# EAGLE design AST1032 (EAGLE 6.3)
DATABASE: ./../../../../../Components/TinyCircuits_Part_Database.txt
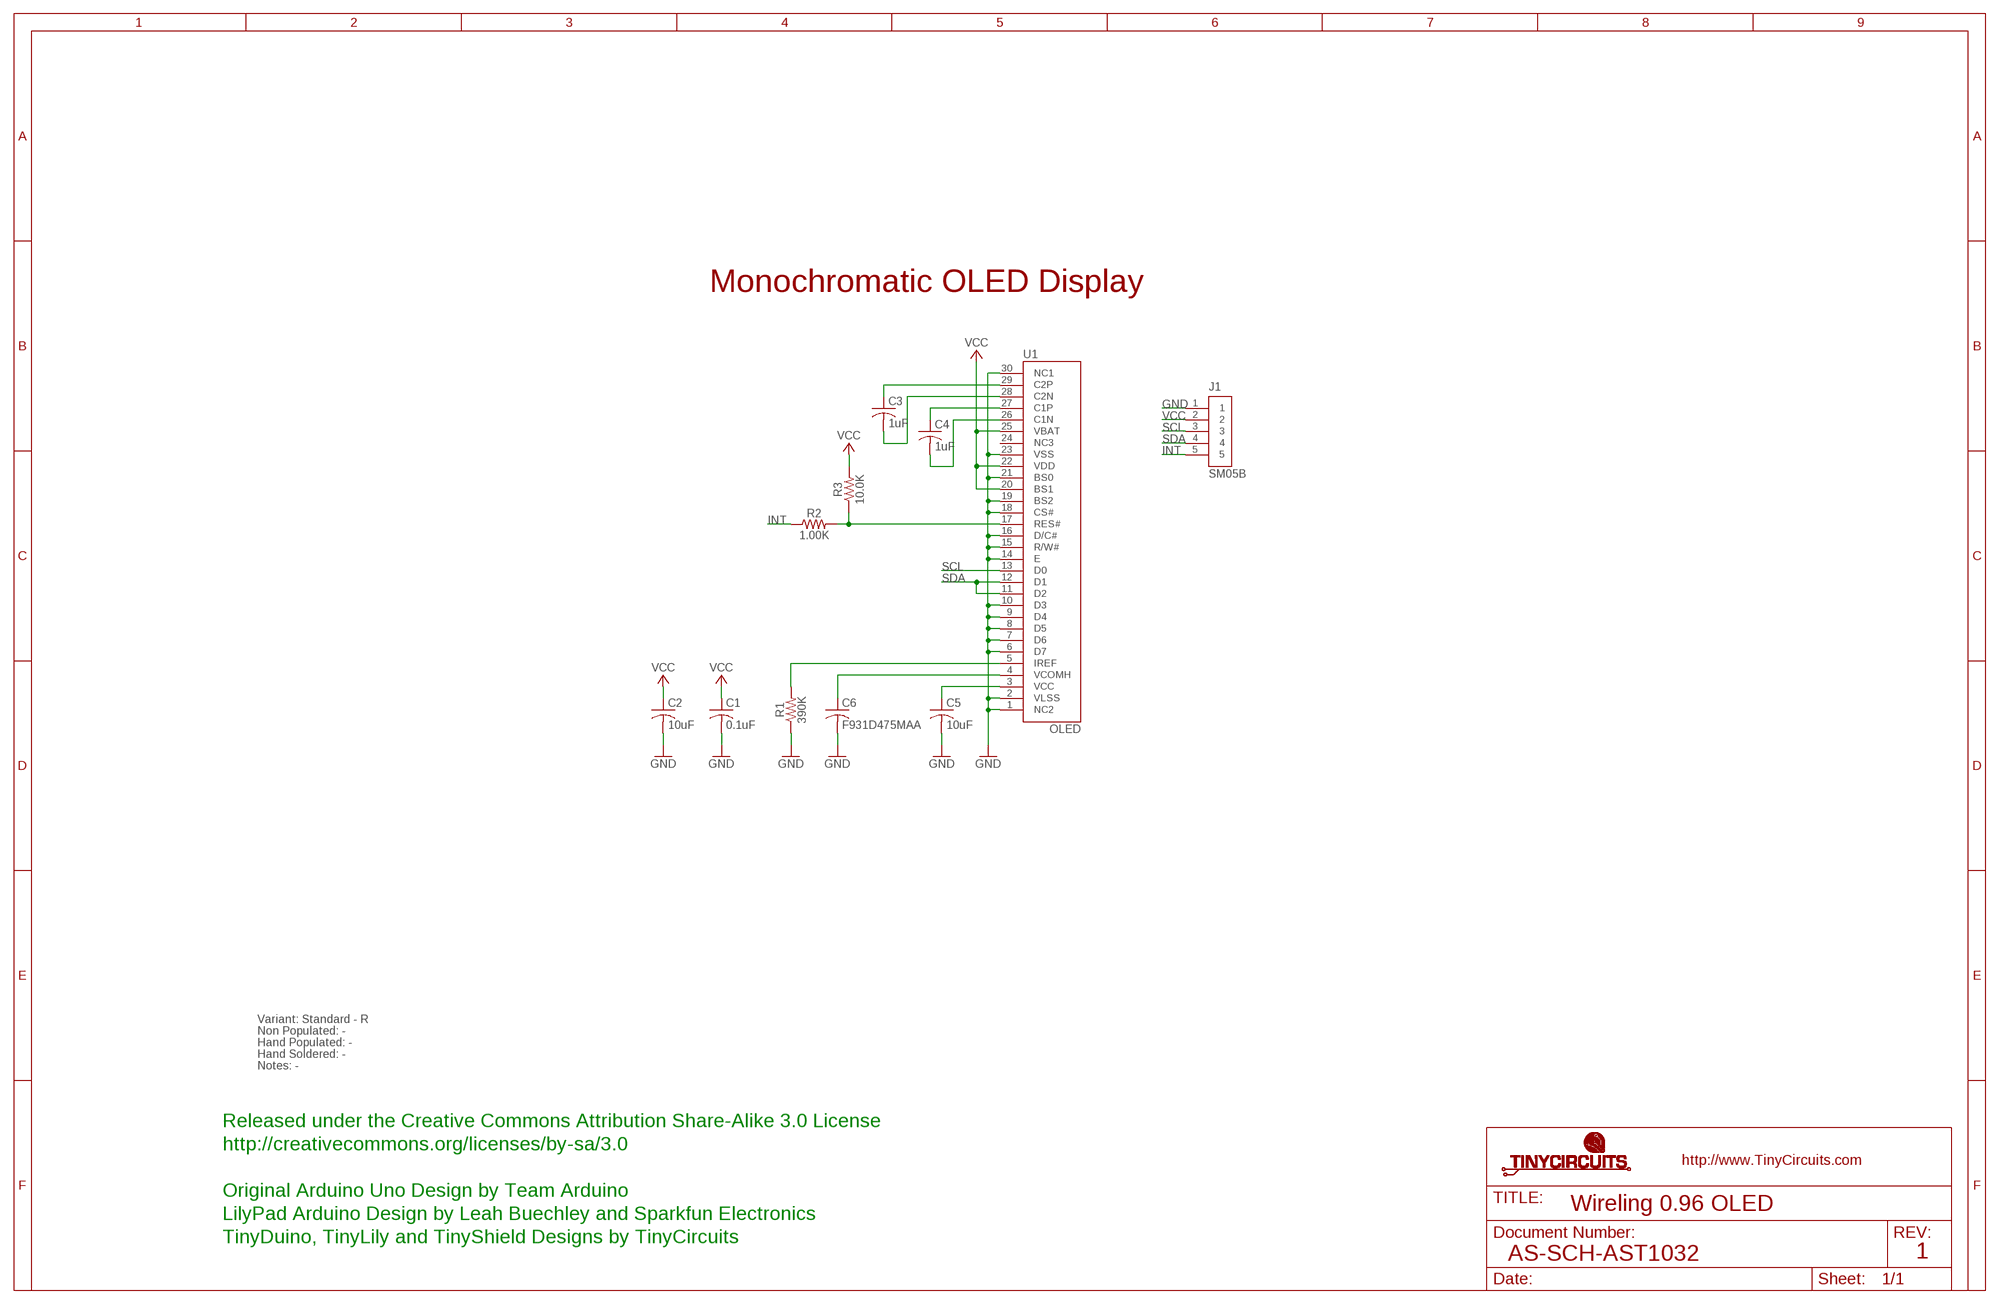
[diagram p0: schematic, sheet 1]

## Parts
C1  0.1uF  AS-ITM-00008  [C0402]
C2  10uF  AS-ITM-00002  [C0603]
C3  1uF  AS-ITM-00347  [C0603]
C4  1uF  AS-ITM-00347  [C0603]
C5  10uF  AS-ITM-00045  [C0805]
C6  F931D475MAA  AS-ITM-00232  [1206_CAP_TANT]
J1  SM05B  AS-ITM-00340  [JST_SH_5X1]
R1  390K  AS-ITM-00346  [0402]
R2  1.00K  AS-ITM-00003  [0402]
R3  10.0K  AS-ITM-00032  [0402]
U1  OLED  AS-ITM-003411  [OLED_WHITE_30P]

## Nets
GND: C1.2 C2.2 C5.2 C6.2 J1.1 R1.1 U1.1(NC2) U1.2(VLSS) U1.6(D7) U1.7(D6) U1.8(D5) U1.9(D4) U1.10(D3) U1.14(E) U1.15(R/W#) U1.16(D/C#) U1.18(CS#) U1.19(BS2) U1.21(BS0) U1.23(VSS) U1.30(NC1)
INT: J1.5 R2.1
N$1: C3.1 U1.29(C2P)
N$2: C3.2 U1.28(C2N)
N$3: C6.1 U1.4(VCOMH)
N$4: C4.1 U1.27(C1P)
N$5: C4.2 U1.26(C1N)
N$7: R1.2 U1.5(IREF)
N$8: C5.1 U1.3(VCC)
N$9: R2.2 R3.1 U1.17(RES#)
SCL: J1.3 U1.13(D0)
SDA: J1.4 U1.11(D2) U1.12(D1)
VCC: C1.1 C2.1 J1.2 R3.2 U1.20(BS1) U1.22(VDD) U1.25(VBAT)
Unconnected: U1.24(NC3)

## Notes on the sheet
- Monochromatic OLED Display
- Variant: Standard - R
- Non Populated: -
- Hand Populated: -
- Hand Soldered: -
- Notes: -
- Released under the Creative Commons Attribution Share-Alike 3.0 License
- http://creativecommons.org/licenses/by-sa/3.0
- Original Arduino Uno Design by Team Arduino
- Wireling 0.96 OLED
- LilyPad Arduino Design by Leah Buechley and Sparkfun Electronics
- TinyDuino, TinyLily and TinyShield Designs by TinyCircuits
- AS-SCH-AST1032 | 1

## Library data of the parts
C1 = tinycircuits:AS-ITM-00008: CAP CER 0.1UF 16V 10% X5R 0402; PARTNO: AS-ITM-00008
C2 = tinycircuits:AS-ITM-00002: CAP CER 10UF 10V 20% X5R 0603; PARTNO: AS-ITM-00002
C3 C4 = tinycircuits:AS-ITM-00347: CAP CER 1UF 16V X7R 0603; PARTNO: AS-ITM-00347
C5 = tinycircuits:AS-ITM-00045: CAP CER 16UF 16V 20% X5R 0805; PARTNO: AS-ITM-00045
C6 = tinycircuits:AS-ITM-00232: CAP TANT 4.7UF 20V 20% 1206; PARTNO: AS-ITM-00232; PNPROTATION: 180
J1 = tinycircuits:AS-ITM-00340: CONN HEADER SH 5POS SIDE 1MM TIN; PARTNO: AS-ITM-00340; PNPROTATION: 180
R1 = tinycircuits:AS-ITM-00346: RES SMD 390K OHM 1% 1/16W 0402; PARTNO: AS-ITM-00346
R2 = tinycircuits:AS-ITM-00003: RES 1.00K OHM 1/16W 1% 0402; PARTNO: AS-ITM-00003
R3 = tinycircuits:AS-ITM-00032: RES 10.0K OHM 1/16W 1% 0402 SMD; PARTNO: AS-ITM-00032
U1 = tinycircuits:AS-ITM-00341: OLED SCREEN WHITE 0.96" 128X64; PARTNO: AS-ITM-00341

## Net classes
2 gnd: width 0.305 mm, drill 0.559 mm, clearance 0.254 mm

## Board
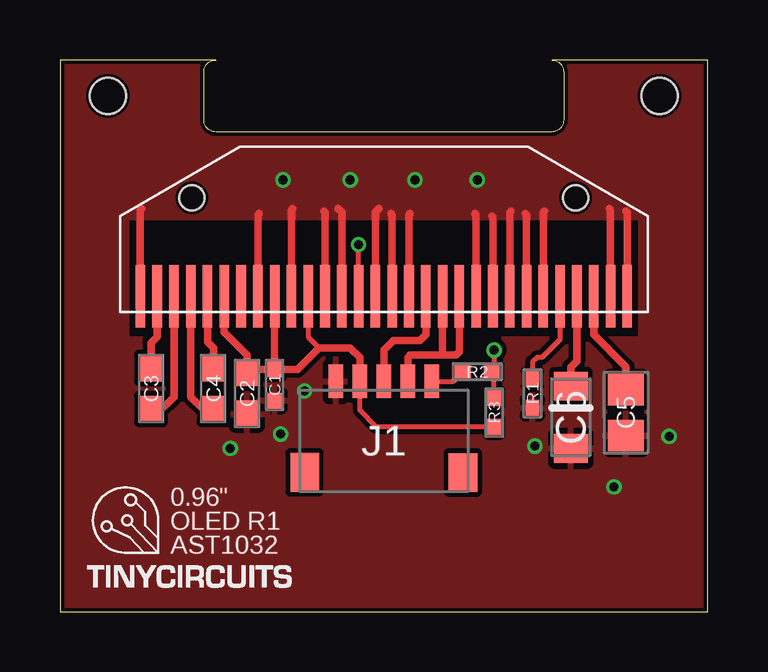
[diagram p1: board, top side]
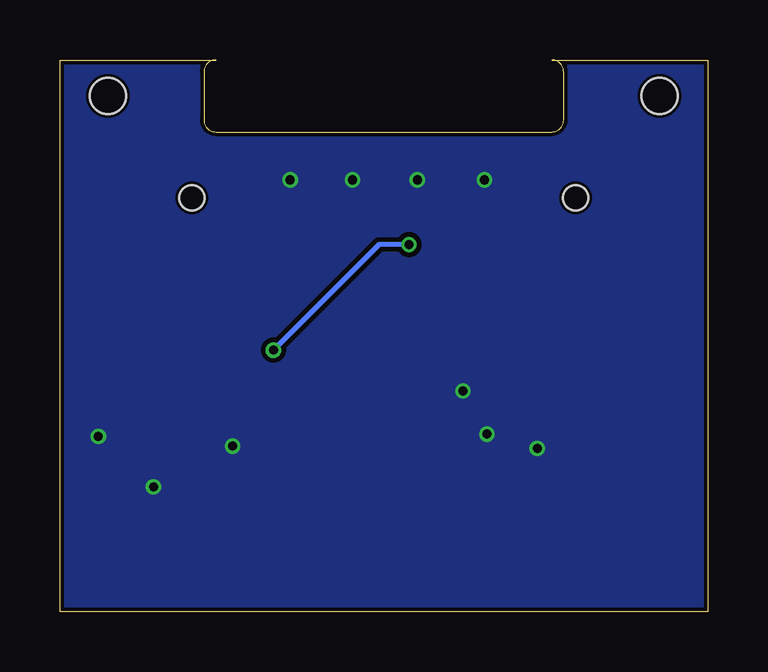
[diagram p2: board, bottom side, seen from below]

Size 27 x 23 mm. Coordinates in mm from the lower left corner, seen from the top.
Outline: 0,0 27,0 27,23 20.5,23 arc-90 21,22.5 21,20.5 arc-90 20.5,20 6.5,20 arc-90 6,20.5 6,22.5 arc-90 6.5,23 0,23 0,0
Copper layers (1*16): Top 0.035mm / dielectric 1.5mm / Bottom 0.035mm
Design rules "default *": minimum track width 8mil, minimum drill 15mil, track to track 8mil, track to pad 8mil, pad to pad 8mil, via to via 8mil, smd to smd 8mil, copper to edge 6mil, drill to drill 8mil, minimum pad ring 8mil, minimum via ring 5mil, stop-mask expansion 4mil, vias tented up to drill 25mil, thermal gap 10mil
Holes 1.5 mm at 2,21.5 25,21.5
tRestrict: area 2.9,11.5 to 24.1,16.3

### Footprints (pad centres in the part's own frame; a part is rotated, then mirrored left to right if it is on the bottom)
C0402 = smd 0.65 x 0.6: 1 -0.65,0; 2 0.65,0
C0603 = smd 1.1 x 1: 1 -0.85,0; 2 0.85,0
C0805 = smd 1.3 x 1.5: 1 -0.95,0; 2 0.95,0
1206_CAP_TANT = smd 1.2 x 1.4: 1 -1.3,0; 2 1.3,0
JST_SH_5X1 = smd 0.6 x 1.4: 1 -2,2.475; 2 -1,2.475; 3 0,2.475; 4 1,2.475; 5 2,2.475 | smd 1.2 x 1.6: PAD1 -3.3,-1.325; PAD2 3.3,-1.325
0402 = smd 0.65 x 0.55: 1 -0.6,0; 2 0.6,0
OLED_WHITE_30P = smd 0.4 x 2.6: 1 10.15,-2.36; 2 9.45,-2.36; 3 8.75,-2.36; 4 8.05,-2.36; 5 7.35,-2.36; 6 6.65,-2.36; 7 5.95,-2.36; 8 5.25,-2.36; 9 4.55,-2.36; 10 3.85,-2.36; 11 3.15,-2.36; 12 2.45,-2.36; 13 1.75,-2.36; 14 1.05,-2.36; 15 0.35,-2.36; 16 -0.35,-2.36; 17 -1.05,-2.36; 18 -1.75,-2.36; 19 -2.45,-2.36; 20 -3.15,-2.36; 21 -3.85,-2.36; 22 -4.55,-2.36; 23 -5.25,-2.36; 24 -5.95,-2.36; 25 -6.65,-2.36; 26 -7.35,-2.36; 27 -8.05,-2.36; 28 -8.75,-2.36; 29 -9.45,-2.36; 30 -10.15,-2.36 | hole 1.05: 8,1.75; -8,1.75

### Placement (x,y rotation side)
C1  8.95,9.45 270 top
C2  7.8,9.1 270 top
C3  3.8,9.3 270 top
C4  6.4,9.3 90 top
C5  23.6,8.3 270 top
C6  21.3,8.1 270 top
J1  13.5,7.12 0 top
R1  19.7,9.1 90 top
R2  17.4,10 0 top
R3  18.1,8.3 270 top
U1  13.5,15.5 0 top
U$1  [DOCFIELD-TINYCIRCUITS-PCB]  37,-10 0 top  (outside the outline)

### Tracks (layer width: path | path; a pad name or v marks a point on that pad's centre or on a via)
GND  (via drill 0.38)
  Top 0.305: U1.30 3.35,16.75 3.4,16.8 | U1.23 8.25,16.55 8.3,16.6 | U1.21 9.65,16.75 9.7,16.8 | U1.19 11.05,16.65 11,16.7 | U1.18 11.75,16.65 11.6,16.8 | U1.16 13.15,16.65 13.3,16.8 | U1.15 13.85,16.55 13.8,16.6 | U1.14 14.55,16.55 14.6,16.6 | U1.10 17.35,16.55 17.3,16.6 | U1.9 18.05,16.45 18,16.5 | U1.8 18.75,16.65 18.8,16.7 | U1.7 19.45,16.55 19.4,16.6 | U1.6 20.15,16.65 20.2,16.7 | U1.2 22.95,16.75 22.9,16.8 | U1.1 23.65,16.65 23.6,16.7
  other vias: 9.2,7.4 7.1,6.8 10.2,9.2 19.8,6.9 25.4,7.3 23.1,5.2 9.3,18 12.1,18 14.8,18 17.4,18
  pour Bottom: 0,23 6,23 6,20 21,20 21,23 27,23 27,0 0,0
  pour Top: 0,23 6,23 6,20 21,20 21,23 27,23 27,0 0,0
INT
  Top 0.203: J1.5 16.4,9.6 R2.1
N$1
  Top 0.305: U1.29 4.05,11.45 3.8,11.2 C3.1
N$2
  Top 0.305: U1.28 4.75,8.95 4.1,8.3 3.85,8.3 C3.2
N$3
  Top 0.305: U1.4 21.55,10.45 21.3,10.2 C6.1
N$4
  Top 0.305: U1.27 5.45,8.95 6,8.4 6.45,8.4 C4.1
N$5
  Top 0.305: U1.26 6.15,11.25 6.4,11 C4.2
N$7
  Top 0.203: U1.5 20.85,11.35 20.1,10.6 19.9,10.6 19.7,10.4 R1.2
N$8
  Top 0.305: U1.3 22.25,11.55 23.6,10.2 C5.1
N$9  (via drill 0.38)
  Top 0.203: R3.1 18.1,9.9 R2.2 18.1,10.1 v18.1,10.9 | U1.17 v12.45,15.3
  Bottom 0.203: v12.45,15.3 13.7,15.3 v18.1,10.9
SCL
  Top 0.305: U1.13 15.25,11.55 15,11.3 13.9,11.3 13.5,10.9 J1.3
SDA
  Top 0.305: U1.12 15.95,10.75 16,10.7 | 16,10.7 14.6,10.7 14.5,10.6 J1.4 | U1.11 16.65,10.85 16.5,10.7 16,10.7
VCC
  Top 0.203: R3.2 13.2,7.7 12.5,8.4 J1.2 | U1.20 10.35,11.45 10.8,11
  Top 0.305: J1.2 12.5,10.6 12.1,11 10.8,11 9.9,10.1 C1.1 | U1.22 C1.1 | C1.1 7.95,10.1 C2.1 7.8,10.7 6.85,11.65 U1.25

### Text on the board
tPlace: 0.96" | OLED R1 | AST1032
Document: FABRICATION DRAWING | NOTES: | 1. PRINTED CIRCUIT BOARD MADE FROM NEMA GRADE FR-4 EPOXY LAMINATE | WITH 1 OUNCE COPPER PLATING AND .024 THICKNESS. | 2. ALL DIMENSIONS ARE GIVEN IN MILLIMETERS. | 3. CIRCUIT PATHS ARE FOR REFERENCE ONLY. | 4. HOLE SIZES SHOWN ARE FINISHED DIAMETERS AFTER PLATING. | 5. BOARD PLATED USING REFLOW OR SIMILAR METHOD. | 6. BOARD TO HAVE BLUE SOLDER MASK ON PLATED SURFACES USING WET FILM | 7. SILKSCREEN BOARD USING WHITE INK. | SR100 OR SR1010 EPOXY. EQUIVALENT WET OR DRY FILM MAY BE USED. | 8. THE FOLLOWING INFORMATION APPLIES TO THIS BOARD: | * 2 COPPER LAYERS | * .024 BOARD THICKNESS | * REQUIRES TOP SIDE SILKSCREEN | Released under the Creative Commons Attribution Share-Alike 3.0 License | http://creativecommons.org/licenses/by-sa/3.0 | Original Arduino Uno Design by Team Arduino | LilyPad Arduino Design by Leah Buechley and Sparkfun Electronics | TinyDuino, TinyLily and TinyShield Designs by TinyCircuits | Wireling 0.96 OLED | AS-PCB-AST1032 | 1